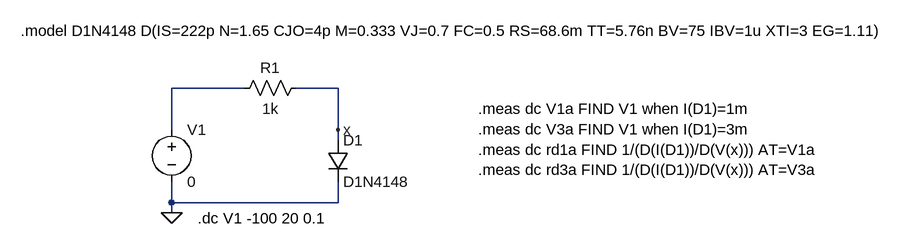
[diagram p0: schematic ej1.1.asc]
ej1.1.asc, the LTspice schematic file:
Version 4.1
SHEET 1 1724 680
WIRE 64 64 -48 64
WIRE 208 64 144 64
WIRE -48 128 -48 64
WIRE 208 128 208 64
WIRE 208 144 208 128
WIRE -48 240 -48 208
WIRE 208 240 208 208
WIRE 208 240 -48 240
WIRE -48 256 -48 240
FLAG 208 128 x
FLAG -48 256 0
SYMBOL voltage -48 112 R0
SYMATTR InstName V1
SYMATTR Value 0
SYMBOL res 160 48 R90
WINDOW 0 0 56 VBottom 2
WINDOW 3 32 56 VTop 2
SYMATTR InstName R1
SYMATTR Value 1k
SYMBOL diode 192 144 R0
SYMATTR InstName D1
SYMATTR Value D1N4148
TEXT -8 264 Left 2 !.dc V1 -100 20 0.1
TEXT -280 -24 Left 2 !.model D1N4148 D(IS=222p N=1.65 CJO=4p M=0.333 VJ=0.7 FC=0.5 RS=68.6m TT=5.76n BV=75 IBV=1u XTI=3 EG=1.11)
TEXT 424 96 Left 2 !.meas dc V1a FIND V1 when I(D1)=1m\n.meas dc V3a FIND V1 when I(D1)=3m\n.meas dc rd1a FIND 1/(D(I(D1))/D(V(x))) AT=V1a\n.meas dc rd3a FIND 1/(D(I(D1))/D(V(x))) AT=V3a

The netlist it stands for:
* ej1.1.asc
V1 N001 0 0
R1 x N001 1k
D1 x 0 D1N4148
.model D D
.lib standard.dio
.dc V1 -100 20 0.1
.model D1N4148 D(IS=222p N=1.65 CJO=4p M=0.333 VJ=0.7 FC=0.5 RS=68.6m TT=5.76n BV=75 IBV=1u XTI=3 EG=1.11)
.meas dc V1a FIND V1 when I(D1)=1m
.meas dc V3a FIND V1 when I(D1)=3m
.meas dc rd1a FIND 1/(D(I(D1))/D(V(x))) AT=V1a
.meas dc rd3a FIND 1/(D(I(D1))/D(V(x))) AT=V3a
.backanno
.end

* Results of the author's LTspice run, read from the files saved beside the schematic
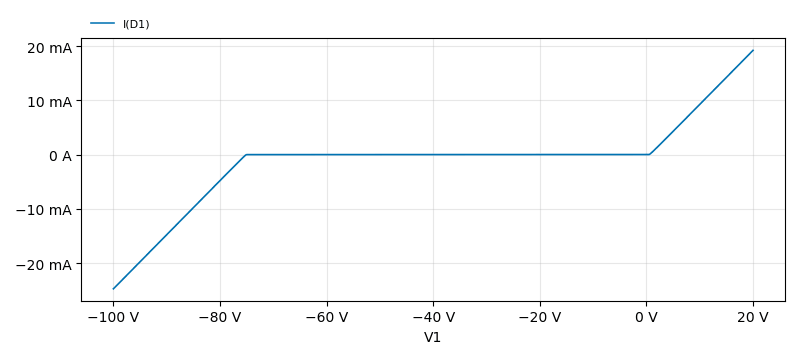
[diagram p1: DC transfer characteristic of ej1.1.asc, plotted from the saved traces]
* DC transfer characteristic, 1 run:
*   I(D1): -24.74 mA at V1=-100 V, 19.22 mA at V1=20 V, min -24.74 mA, max 19.22 mA
* From the log:
*   v1a: V1 =1.653861449 at 1.653861449
*   v3a: V1 =3.70093070468 at 3.70093070468
*   rd1a: 1/(D(I(D1))/D(V(x))) =42.9268458515 at 1.653861449
*   rd3a: 1/(D(I(D1))/D(V(x))) =14.0693680378 at 3.70093070468